# EasyEDA schematic SCH BOTTOM BOARD.json
TITLE: Sheet_1; REV: 1.0; Date: 2022-10-06; Sheet: 1/1; Drawn By: evolutiontechnologyindonesia; Company: Your Company
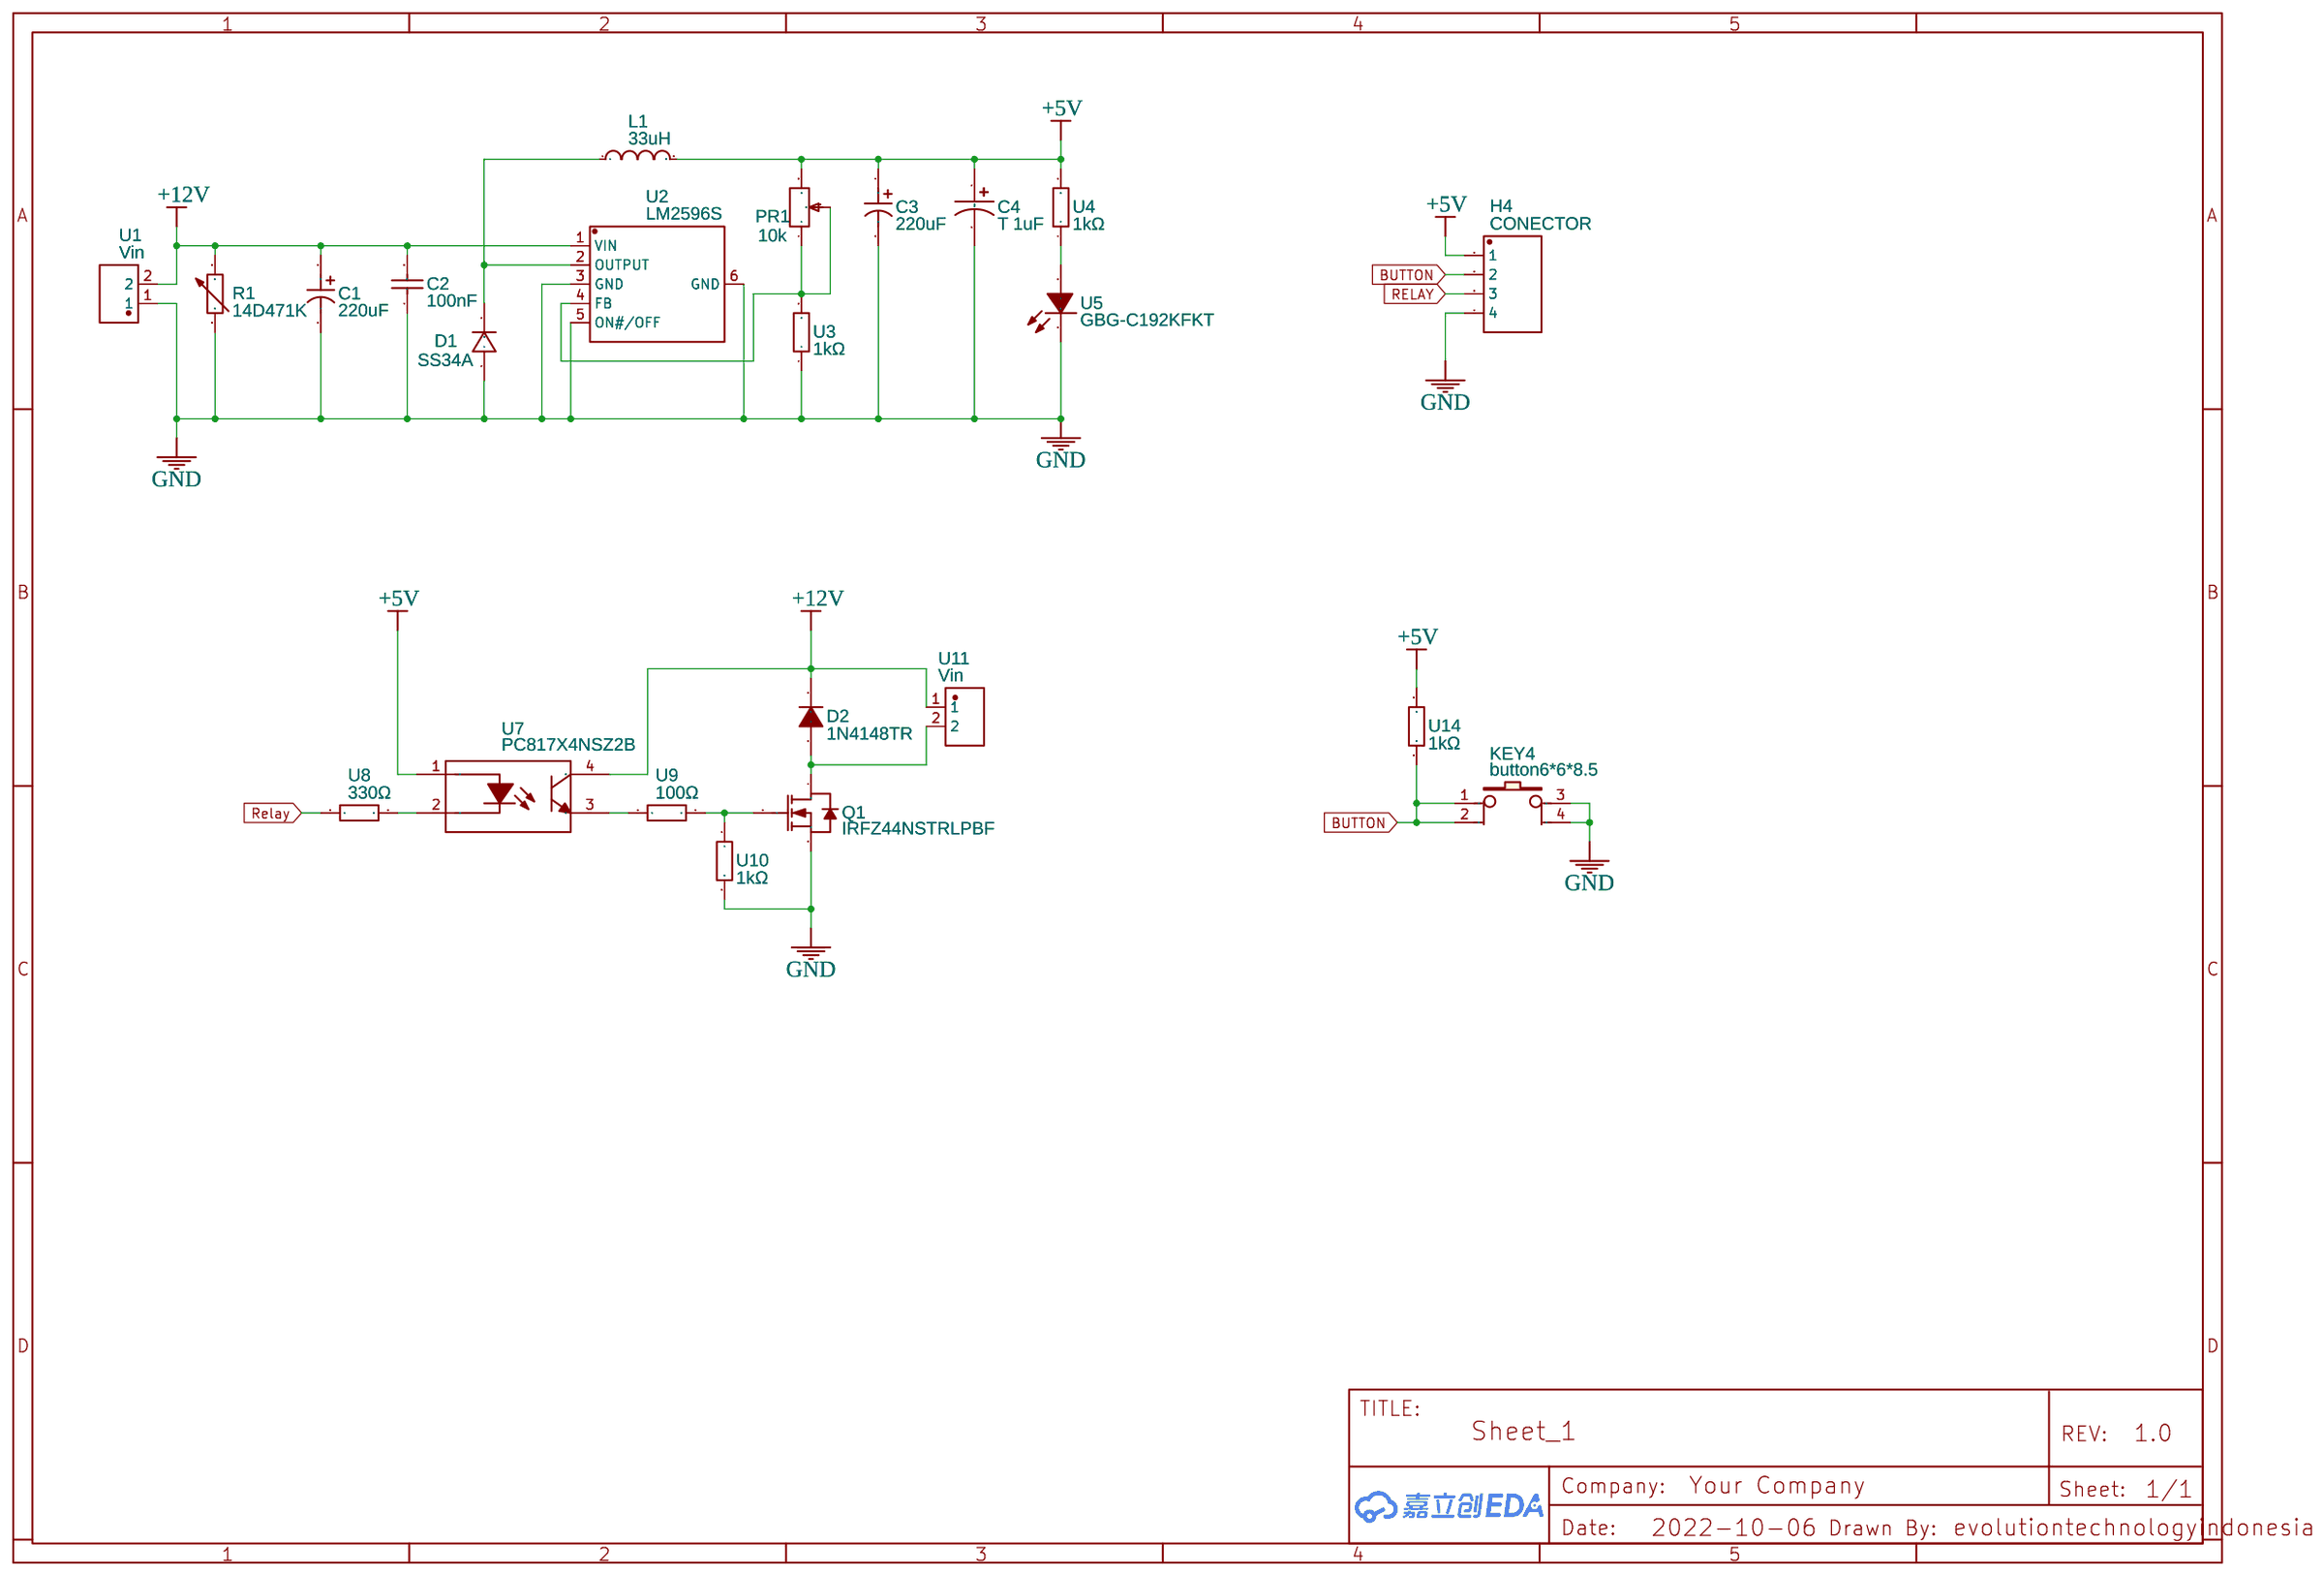
[diagram p0: schematic sheet]

## Parts
C1  220uF  [CAP-SMD_BD10.0-L10.3-W10.3-LS11.0-FD]
C2  100nF  [C0805]
C3  220uF  [CAP-SMD_BD10.0-L10.3-W10.3-LS11.0-FD]
C4  T 1uF  [CASE-C_6032]
D1  SS34A  [SMA_L4.3-W2.6-LS5.2-RD]
D2  1N4148TR  [DO-35_BD2.0-L4.2-P8.20-D0.5-RD]
H4  CONECTOR  [HDR-TH_4P-P2.54-V-M]
KEY4  button6*6*8.5  [KEY-TH_4P-L6.0-W6.0-P4.50]
L1  33uH  [IND-SMD_L10.4-W10.3]
PR1  10k  [RES-ADJ-TH_3296W]
Q1  IRFZ44NSTRLPBF  [TO-263-2_L10.0-W9.1-P5.08-LS15.2-TL]
R1  14D471K  [RES-TH_L16.5-W5.9-P7.50-D0.9-S5.90]
U1  Vin  [CONN-TH_P5.08_KF129-5.08-2P]
U2  LM2596S  [TO-263-5_L10.2-W8.6-P1.70-LS14.4-TL]
U3  1kΩ  [R0805]
U4  1kΩ  [R0805]
U5  GBG-C192KFKT  [LED0603-RD]
U7  PC817X4NSZ2B  [DIP-4_L6.4-W4.6-P2.54-LS7.6-BL]
U8  330Ω  [R0805]
U9  100Ω  [R0805]
U10  1kΩ  [R0805]
U11  Vin  [CONN-TH_P5.08_KF129-5.08-2P]
U14  1kΩ  [R0805]

## Library data of the parts
C1 C3 = RVT220UF50V67RV0021: Supplier: LCSC; Supplier Part: C2887271; Manufacturer: KNSCHA(科尼盛); JLCPCB Part Class: Extended Part; Contributor: LCSC
C2 = 0805B104J500NT: Supplier: LCSC; Manufacturer: FH; Supplier Part: C29926; JLCPCB Part Class: Extended Part
C4 = 293D156X9016C2TE3: Supplier: LCSC; Supplier Part: C506624; Manufacturer: Vishay Intertech; Contributor: LCSC; JLCPCB Part Class: Extended Part
D1 = SS34A: Supplier: LCSC; Supplier Part: C211775; Manufacturer: Yangzhou Yangjie Elec Tech; Contributor: LCSC; JLCPCB Part Class: Extended Part
D2 = 1N4148TR: Supplier: LCSC; Manufacturer: FAIRCHILD; Supplier Part: C84410; JLCPCB Part Class: Extended Part
H4 = Header-Male-2.54_1x4: Supplier: LCSC; Manufacturer: Ckmtw(灿科盟); Manufacturer Part: B-2100S04P-A110; Contributor: LCSC; Supplier Part: C124378; JLCPCB Part Class: Extended Part
KEY4 = button6*6*8.5: Supplier Part: C59980; Supplier: LCSC; Manufacturer: ReliaPro
L1 = SMDRH104R-330MT: Supplier: LCSC; Manufacturer: SXN; Supplier Part: C9936; JLCPCB Part Class: Extended Part
PR1 = 3296W-1-502_C5032: Supplier Part: C5032; Supplier: LCSC; Manufacturer: ReliaPro; Manufacturer Part: 3296W-1-502
Q1 = IRFZ44NSTRLPBF: Supplier: LCSC; Manufacturer: IR; Supplier Part: C58228; JLCPCB Part Class: Extended Part
R1 = 14D471K: Supplier: LCSC; Manufacturer: HEL; Supplier Part: C111189; JLCPCB Part Class: Extended Part
U1 U11 = KF129-5.08-2P: Supplier: LCSC; Supplier Part: C475092; Manufacturer: Cixi Kefa Elec; Contributor: LCSC; JLCPCB Part Class: Extended Part
U2 = LM2596S-5.0/TR: Supplier: LCSC; Supplier Part: C194349; Manufacturer: HGSEMI; Contributor: LCSC; JLCPCB Part Class: Extended Part
U3 U4 U8-U10 U14 = HPCR0805F13K0K9: Supplier: LCSC; Supplier Part: C365241; Manufacturer: ResistorToday; Resistance (Ohms): 13K; Contributor: LCSC
U5 = GBG-C192KFKT: Supplier: LCSC; Supplier Part: C2892159; Manufacturer: GBG; link: https://atta.szlcsc.comnull; Contributor: lcsc
U7 = PC817X4NSZ2B: Supplier: LCSC; Supplier Part: C394683; Manufacturer: Sharp Microelectronics; Contributor: LCSC; JLCPCB Part Class: Extended Part

## Nets
+5V: C3.1 C4.1 H4.1 L1.2 PR1.3 U4.2 U7.1(AN) U14.1
+12V: C1.1 C2.2 D2.1(C) R1.2 U1.2 U2.1(VIN) U7.4(COL) U11.1
GND: C1.2 C2.1 C3.2 C4.2 D1.2(A) H4.4 KEY4.3 KEY4.4 Q1.3(S) R1.1 U1.1 U2.3(GND) U2.5(ON#/OFF) U2.6(GND) U3.1 U5.1(C) U10.2
BUTTON: H4.2 KEY4.1 KEY4.2 U14.2
Relay: U8.2
RELAY: H4.3
Net-(D1-1): D1.1(C) L1.1 U2.2(OUTPUT)
Net-(D2-2): D2.2(A) Q1.4(D) U11.2
Net-(PR1-1): PR1.1 PR1.2 U2.4(FB) U3.2
Net-(Q1-1): Q1.1(G) U9.1 U10.1
Net-(U4-1): U4.1 U5.2(A)
Net-(U7-2): U7.2(CAT) U8.1
Net-(U7-3): U7.3(EM) U9.2
